# Altium schematic sheet I2S Audio.SchDoc: I2S Codec/Amplifier
size Tabloid; ApprovedBy: NA; CompanyName: Cospan Design LLC; DrawnBy: Dave McCoy; Engineer: Dave McCoy; DocumentNumber: 13; Revision: A; SheetNumber: 13; SheetTotal: 20; Client: Public; Project: Enigma; ProjectPrettyName: Enigma
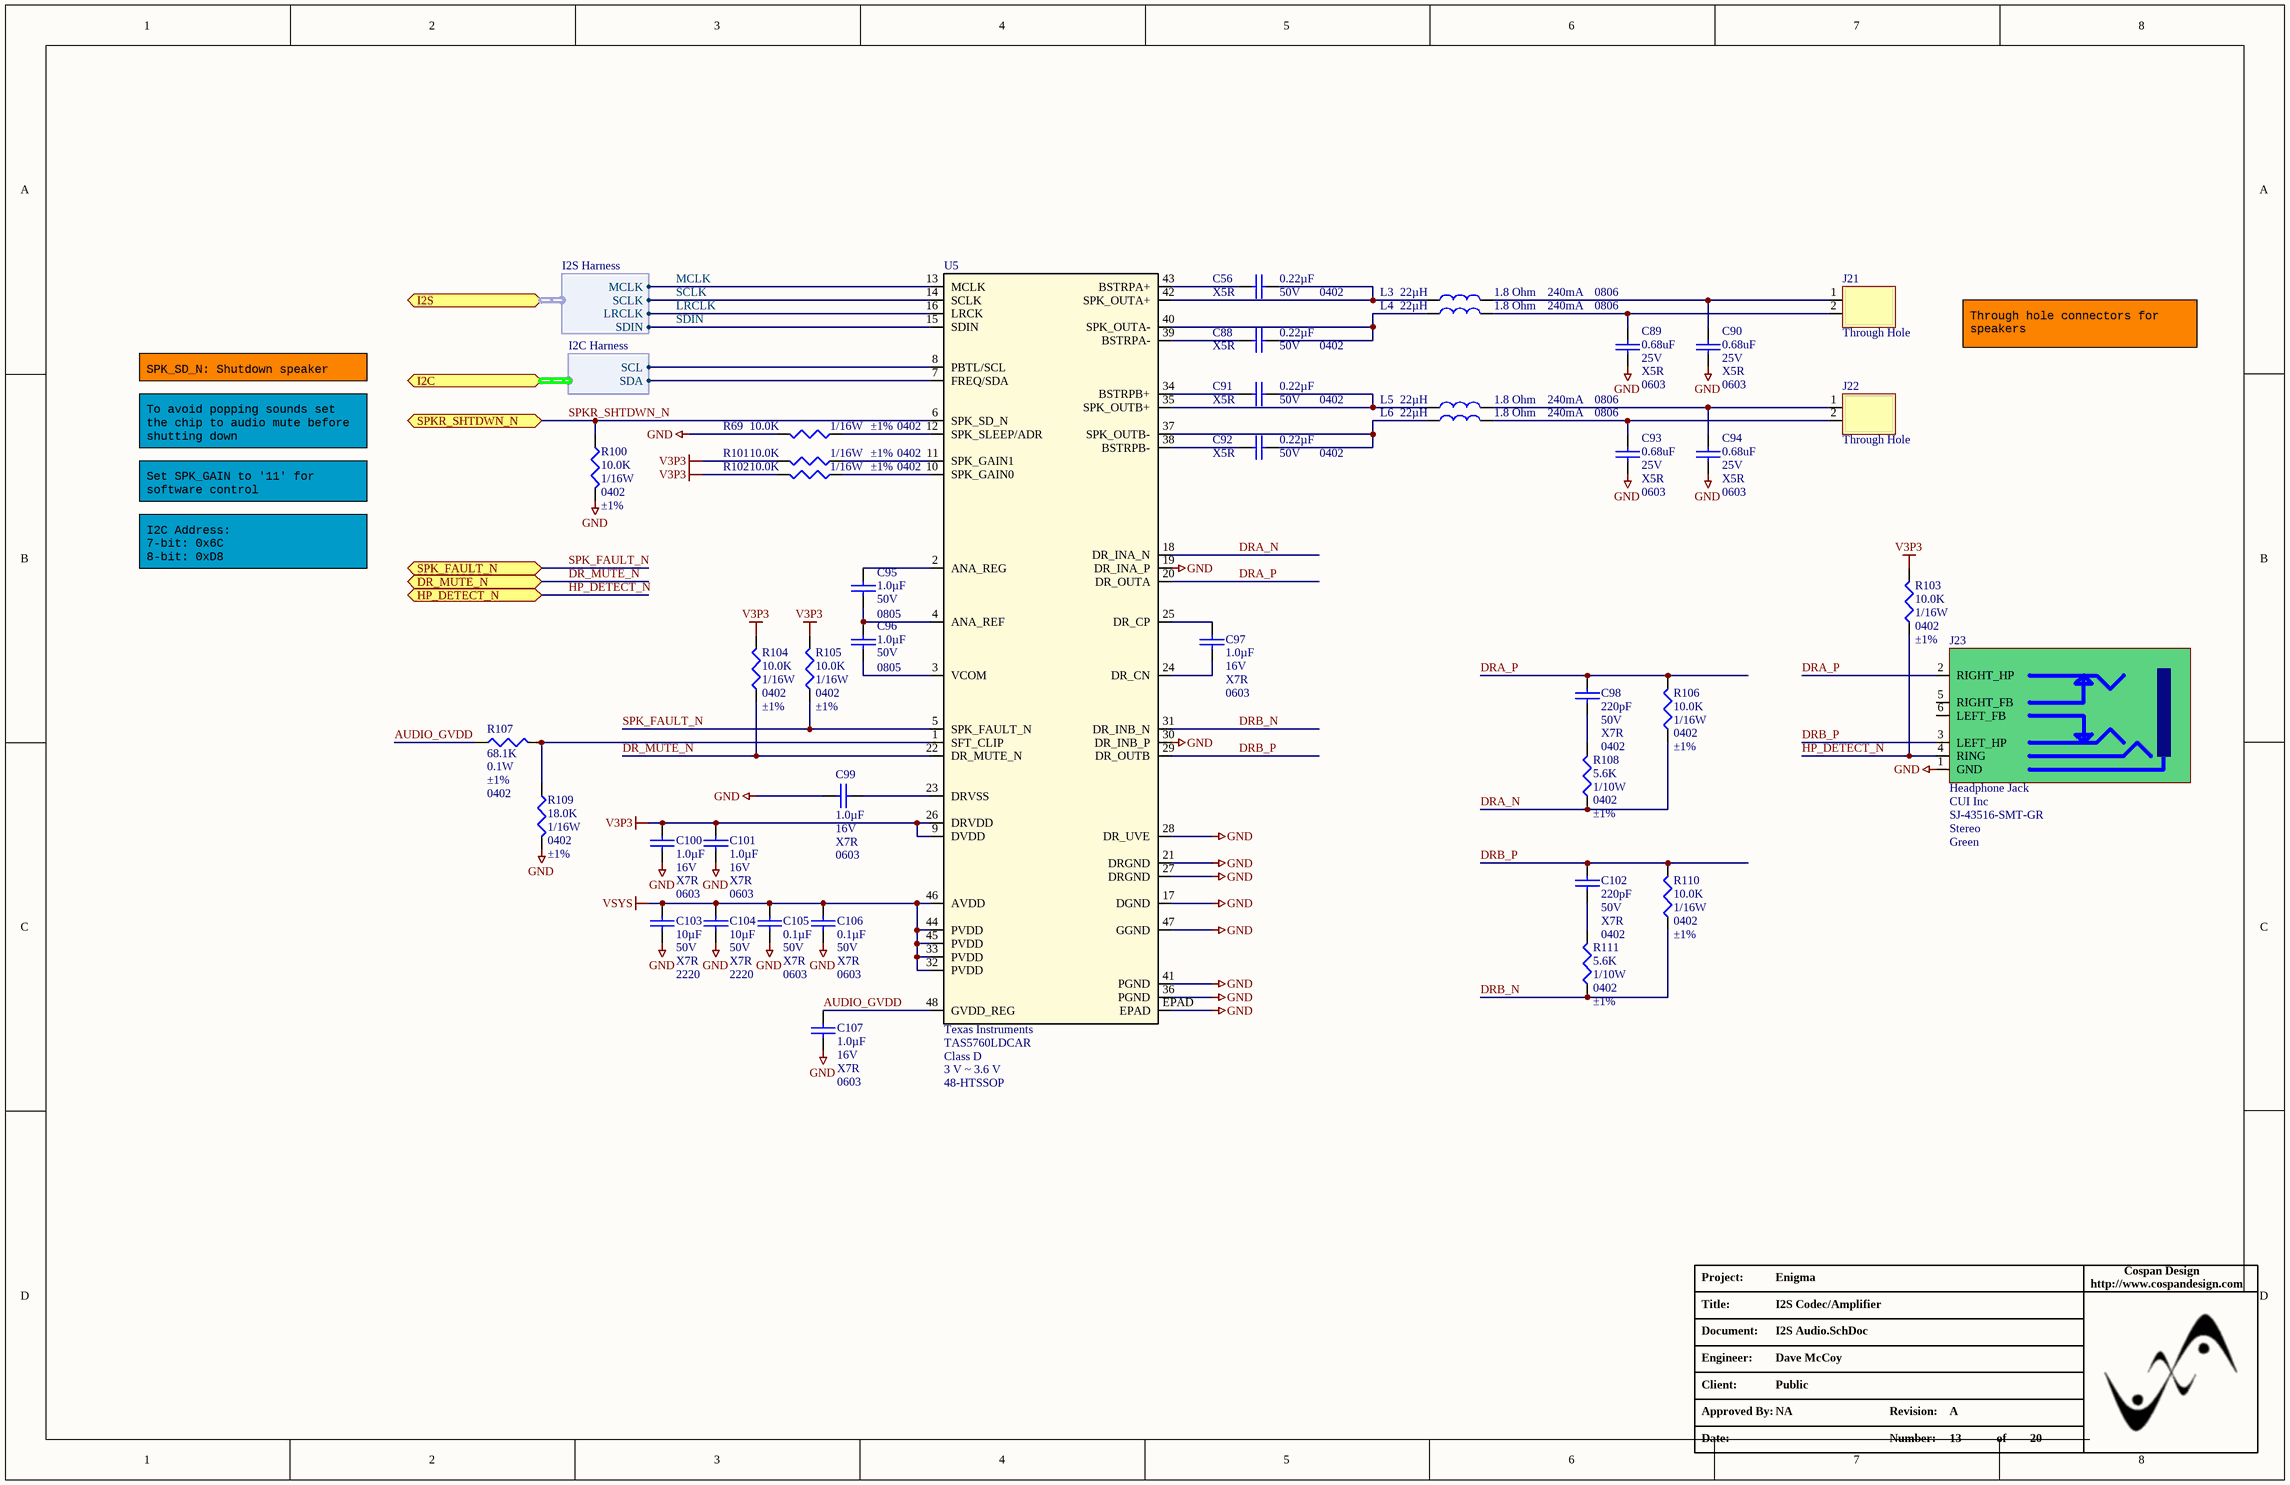
[diagram p0: I2S Audio.SchDoc]

## Parts
C56  Capacitance: 0.22µF  Voltage - Rated: 50V  Temperature Coefficient: X5R  Package / Case: 0402  [C_0402]  (hidden comment: C_0402_0.22UF_50V)
C88  Capacitance: 0.22µF  Voltage - Rated: 50V  Temperature Coefficient: X5R  Package / Case: 0402  [C_0402]  (hidden comment: C_0402_0.22UF_50V)
C89  Capacitance: 0.68uF  Voltage - Rated: 25V  Temperature Coefficient: X5R  Package / Case: 0603  [C_ERA-0603]  (hidden comment: C_0603_0.68uF_25V)
C90  Capacitance: 0.68uF  Voltage - Rated: 25V  Temperature Coefficient: X5R  Package / Case: 0603  [C_ERA-0603]  (hidden comment: C_0603_0.68uF_25V)
C91  Capacitance: 0.22µF  Voltage - Rated: 50V  Temperature Coefficient: X5R  Package / Case: 0402  [C_0402]  (hidden comment: C_0402_0.22UF_50V)
C92  Capacitance: 0.22µF  Voltage - Rated: 50V  Temperature Coefficient: X5R  Package / Case: 0402  [C_0402]  (hidden comment: C_0402_0.22UF_50V)
C93  Capacitance: 0.68uF  Voltage - Rated: 25V  Temperature Coefficient: X5R  Package / Case: 0603  [C_ERA-0603]  (hidden comment: C_0603_0.68uF_25V)
C94  Capacitance: 0.68uF  Voltage - Rated: 25V  Temperature Coefficient: X5R  Package / Case: 0603  [C_ERA-0603]  (hidden comment: C_0603_0.68uF_25V)
C95  Capacitance: 1.0µF  Voltage - Rated: 50V  Package / Case: 0805  [C_ERA-0805]  (hidden comment: 1.0uF)
C96  Capacitance: 1.0µF  Voltage - Rated: 50V  Package / Case: 0805  [C_ERA-0805]  (hidden comment: 1.0uF)
C97  Capacitance: 1.0µF  Voltage - Rated: 16V  Temperature Coefficient: X7R  Package / Case: 0603  [C_ERA-0603]  (hidden comment: 1.0uF)
C98  Voltage - Rated: 50V  Temperature Coefficient: X7R  Package / Case: 0402  [C_0402]  (hidden comment: 220pF)
C99  Capacitance: 1.0µF  Voltage - Rated: 16V  Temperature Coefficient: X7R  Package / Case: 0603  [C_ERA-0603]  (hidden comment: 1.0uF)
C100  Capacitance: 1.0µF  Voltage - Rated: 16V  Temperature Coefficient: X7R  Package / Case: 0603  [C_ERA-0603]  (hidden comment: 1.0uF)
C101  Capacitance: 1.0µF  Voltage - Rated: 16V  Temperature Coefficient: X7R  Package / Case: 0603  [C_ERA-0603]  (hidden comment: 1.0uF)
C102  Voltage - Rated: 50V  Temperature Coefficient: X7R  Package / Case: 0402  [C_0402]  (hidden comment: 220pF)
C103  Voltage - Rated: 50V  Temperature Coefficient: X7R  Package / Case: 2220  [C_ERA-2220]  (hidden comment: 10µF)
C104  Voltage - Rated: 50V  Temperature Coefficient: X7R  Package / Case: 2220  [C_ERA-2220]  (hidden comment: 10µF)
C105  Capacitance: 0.1µF  Voltage - Rated: 50V  Temperature Coefficient: X7R  Package / Case: 0603  [C_ERA-0603]  (hidden comment: C_0603_0.1µF)
C106  Capacitance: 0.1µF  Voltage - Rated: 50V  Temperature Coefficient: X7R  Package / Case: 0603  [C_ERA-0603]  (hidden comment: C_0603_0.1µF)
C107  Capacitance: 1.0µF  Voltage - Rated: 16V  Temperature Coefficient: X7R  Package / Case: 0603  [C_ERA-0603]  (hidden comment: 1.0uF)
J21  Mounting Type: Through Hole  [HDR_1X2]  (hidden comment: J_HDR1X2_JUMPER)  (no BOM)
J22  Mounting Type: Through Hole  [HDR_1X2]  (hidden comment: J_HDR1X2_JUMPER)  (no BOM)
J23  Headphone Jack  Manufacturer: CUI Inc  Manufacturer Part Number: SJ-43516-SMT-GR  Signal Lines: Stereo  Color: Green  [HEADPHONE_JACK]
L3  Current: 240mA  Package / Case: 0806  Inductance: 22µH  DC Resistance (DCR): 1.8 Ohm  [L_0806]  (hidden comment: CBC2016T220K)
L4  Current: 240mA  Package / Case: 0806  Inductance: 22µH  DC Resistance (DCR): 1.8 Ohm  [L_0806]  (hidden comment: CBC2016T220K)
L5  Current: 240mA  Package / Case: 0806  Inductance: 22µH  DC Resistance (DCR): 1.8 Ohm  [L_0806]  (hidden comment: CBC2016T220K)
L6  Current: 240mA  Package / Case: 0806  Inductance: 22µH  DC Resistance (DCR): 1.8 Ohm  [L_0806]  (hidden comment: CBC2016T220K)
R69  Resistance In Ohms: 10.0K  Power (Watts): 1/16W  Case: 0402  Tolerance: ±1%  [R_0402]  (hidden comment: R_0402_10.0K)
R100  Resistance In Ohms: 10.0K  Power (Watts): 1/16W  Case: 0402  Tolerance: ±1%  [R_0402]  (hidden comment: R_0402_10.0K)
R101  Resistance In Ohms: 10.0K  Power (Watts): 1/16W  Case: 0402  Tolerance: ±1%  [R_0402]  (hidden comment: R_0402_10.0K)
R102  Resistance In Ohms: 10.0K  Power (Watts): 1/16W  Case: 0402  Tolerance: ±1%  [R_0402]  (hidden comment: R_0402_10.0K)
R103  Resistance In Ohms: 10.0K  Power (Watts): 1/16W  Case: 0402  Tolerance: ±1%  [R_0402]  (hidden comment: R_0402_10.0K)
R104  Resistance In Ohms: 10.0K  Power (Watts): 1/16W  Case: 0402  Tolerance: ±1%  [R_0402]  (hidden comment: R_0402_10.0K)
R105  Resistance In Ohms: 10.0K  Power (Watts): 1/16W  Case: 0402  Tolerance: ±1%  [R_0402]  (hidden comment: R_0402_10.0K)
R106  Resistance In Ohms: 10.0K  Power (Watts): 1/16W  Case: 0402  Tolerance: ±1%  [R_0402]  (hidden comment: R_0402_10.0K)
R107  Resistance In Ohms: 68.1K  Power (Watts): 0.1W  Tolerance: ±1%  Case: 0402  [R_0402]  (hidden comment: R_0402_68.1K)
R108  Resistance In Ohms: 5.6K  Power (Watts): 1/10W  Case: 0402  Tolerance: ±1%  [R_0402]  (hidden comment: 5.6k Ohms)
R109  Resistance In Ohms: 18.0K  Power (Watts): 1/16W  Case: 0402  Tolerance: ±1%  [R_0402]  (hidden comment: 18.0k Ohms)
R110  Resistance In Ohms: 10.0K  Power (Watts): 1/16W  Case: 0402  Tolerance: ±1%  [R_0402]  (hidden comment: R_0402_10.0K)
R111  Resistance In Ohms: 5.6K  Power (Watts): 1/10W  Case: 0402  Tolerance: ±1%  [R_0402]  (hidden comment: 5.6k Ohms)
U5  Manufacturer: Texas Instruments  Manufacturer Part Number: TAS5760LDCAR  Type: Class D  Voltage - Supply: 3 V ~ 3.6 V  Supplier Device Package: 48-HTSSOP  [DCA48_6P4X3P6]  (hidden comment: U_TAS5760LDCAR)

## Ports
DR_MUTE_N, HP_DETECT_N, I2C (harness I2C Harness), I2S (harness I2S Harness), SPK_FAULT_N, SPKR_SHTDWN_N

## Harnesses
I2C Harness: SCL, SDA
I2S Harness: MCLK, SCLK, LRCLK, SDIN

## Nets
GND: C89.1 C90.1 C93.1 C94.1 C99.1 C100.1 C101.1 C103.1 C104.1 C105.1 C106.1 C107.1 J23.1(GND) R69.1 R100.1 R109.2 U5.17(DGND) U5.19(DR_INA_P) U5.21(DRGND) U5.27(DRGND) U5.28(DR_UVE) U5.30(DR_INB_P) U5.36(PGND) U5.41(PGND) U5.47(GGND) U5.EPAD
V3P3: C100.2 C101.2 R101.1 R102.1 R103.1 R104.2 R105.2 U5.9(DVDD) U5.26(DRVDD)
VSYS: C103.2 C104.2 C105.2 C106.2 U5.32(PVDD) U5.33(PVDD) U5.44(PVDD) U5.45(PVDD) U5.46(AVDD)
AUDIO_GVDD: C107.2 R107.1 U5.48(GVDD_REG)
DR_MUTE_N: R104.1 U5.22(DR_MUTE_N) ; port DR_MUTE_N
DRA_N: R106.2 R108.2 U5.18(DR_INA_N)
DRA_P: C98.2 J23.2(RIGHT_HP) R106.1 U5.20(DR_OUTA)
DRB_N: R110.2 R111.2 U5.31(DR_INB_N)
DRB_P: C102.2 J23.3(LEFT_HP) R110.1 U5.29(DR_OUTB)
HP_DETECT_N: J23.4(RING) R103.2 ; port HP_DETECT_N
LRCLK: U5.16(LRCK) ; port I2S.LRCLK
MCLK: U5.13(MCLK) ; port I2S.MCLK
SCLK: U5.14(SCLK) ; port I2S.SCLK
SDIN: U5.15(SDIN) ; port I2S.SDIN
SPK_FAULT_N: R105.1 U5.5(SPK_FAULT_N) ; port SPK_FAULT_N
SPKR_SHTDWN_N: R100.2 U5.6(SPK_SD_N) ; port SPKR_SHTDWN_N
NetC56_1: C56.1 L3.1 U5.42(SPK_OUTA+)
NetC56_2: C56.2 U5.43(BSTRPA+)
NetC88_1: C88.1 L4.1 U5.40(SPK_OUTA-)
NetC88_2: C88.2 U5.39(BSTRPA-)
NetC89_2: C89.2 J21.2 L4.2
NetC90_2: C90.2 J21.1 L3.2
NetC91_1: C91.1 L5.1 U5.35(SPK_OUTB+)
NetC91_2: C91.2 U5.34(BSTRPB+)
NetC92_1: C92.1 L6.1 U5.37(SPK_OUTB-)
NetC92_2: C92.2 U5.38(BSTRPB-)
NetC93_2: C93.2 J22.2 L6.2
NetC94_2: C94.2 J22.1 L5.2
NetC95_1: C95.1 C96.2 U5.4(ANA_REF)
NetC95_2: C95.2 U5.2(ANA_REG)
NetC96_1: C96.1 U5.3(VCOM)
NetC97_1: C97.1 U5.24(DR_CN)
NetC97_2: C97.2 U5.25(DR_CP)
NetC98_1: C98.1 R108.1
NetC99_2: C99.2 U5.23(DRVSS)
NetC102_1: C102.1 R111.1
NetR69_2: R69.2 U5.12(SPK_SLEEP/ADR)
NetR101_2: R101.2 U5.11(SPK_GAIN1)
NetR102_2: R102.2 U5.10(SPK_GAIN0)
NetR107_2: R107.2 R109.1 U5.1(SFT_CLIP)
NetU5_7: U5.7(FREQ/SDA) ; port I2C.SDA
NetU5_8: U5.8(PBTL/SCL) ; port I2C.SCL

Not connected (* = marked no-connect by the designer): J23 5(RIGHT_FB) 6(LEFT_FB)

## Notes on the sheet
- Through hole connectors for speakers
- SPK_SD_N: Shutdown speaker
- Set SPK_GAIN to '11' for software control
- To avoid popping sounds set the chip to audio mute before shutting down
- I2C Address:
  7-bit: 0x6C
  8-bit: 0xD8
- Project:
- http://www.cospandesign.com
- Cospan Design
- Document:
- Engineer:
- Title:
- Client:
- Approved By:
- Revision:
- Date:
- Number:
- of

## Library data of the parts
C56 C88 C91 C92 = C_0402_0.22UF_50V: CAP CER 0.22UF 50V X5R 0402; Manufacturer: Taiyo Yuden; Manufacturer Part Number: UMK105BJ224KV-F; Tolerance: ±10%; Supplier 1: Digi-Key; RoHS: RoHS Compliant; Category: Capacitors; Stock 1: 141424; Pricing 1: 1=0.35, 10=0.263, 50=0.1532, 100=0.1225, 250=0.08752, 500=0.0595, 1000=0.04813, 5000=0.03763 (USD); Packaging: Digi-Reel®; Mounting Type: Surface Mount, MLCC; Operating Temperature: -55°C ~ 85°C; Applications: General Purpose; Ratings: -; Size / Dimension: 0.039" L x 0.020" W (1.00mm x 0.50mm); Height - Seated (Max): -; Thickness (Max): 0.022" (0.55mm); Lead Spacing: -; Features: -; Lead Style: -; ComponentLink1URL: http://ds.yuden.co.jp/TYCOMPAS/ut/detail.do?productNo=UMK105BJ224KV-F&fileName=UMK105BJ224KV-F_SS&mode=specSheetDownload; ComponentLink1Description: http://ds.yuden.co.jp/TYCOMPAS/ut/detail.do?productNo=UMK105BJ224KV-F&fileName=UMK105BJ224KV-F_SS&mode=specSheetDownload; Supplier Part Number 1: 587-3500-6-ND
C89 C90 C93 C94 = C_0603_0.68uF_25V: CAP CER 0.68UF 25V X5R 0603; Manufacturer: Wurth Electronics Inc.; Manufacturer Part Number: 885012106021; Tolerance: ±20%; Supplier 1: Digi-Key; RoHS: RoHS Compliant; Category: Capacitors; Stock 1: 3388; Pricing 1: 1=0.16, 50=0.131, 100=0.103, 250=0.091, 500=0.083, 1000=0.077 (USD); Packaging: Cut Tape (CT); Part Status: Active; Operating Temperature: -55°C ~ 85°C; Features: -; Ratings: -; Applications: General Purpose; Mounting Type: Surface Mount, MLCC; Size / Dimension: 0.063" L x 0.031" W (1.60mm x 0.80mm); Height - Seated (Max): -; Thickness (Max): 0.037" (0.95mm); Lead Spacing: -; Lead Style: -; ComponentLink1URL: http://katalog.we-online.de/pbs/datasheet/885012106021.pdf; ComponentLink1Description: http://katalog.we-online.de/pbs/datasheet/885012106021.pdf; Supplier Part Number 1: 732-7918-1-ND
C95 C96 = C_0805_1.0uF_50V: CAP CER 1UF 50V X7R 0805; Manufacturer: Murata Electronics North America; Manufacturer Part Number: GRM21BR71H105KA12L; Tolerance: ±10%; Supplier 1: Digi-Key; RoHS: RoHS Compliant; Category: Capacitors; Stock 1: 322160; Pricing 1: 10=0.529, 100=0.3127, 500=0.18038, 1000=0.12506 (USD); Mounting Type: Surface Mount, MLCC; Operating Temperature: -55°C ~ 125°C; Features: -; Applications: General Purpose; Ratings: -; Size / Dimension: 0.079" L x 0.049" W (2.00mm x 1.25mm); Lead Spacing: -; Thickness: 1.25mm; Packaging: Cut Tape (CT); Lead Style: -; ComponentLink1URL: http://search.murata.co.jp/Ceramy/image/img/PDF/ENG/GRM21BR71H105KA12.pdf; ComponentLink1Description: http://search.murata.co.jp/Ceramy/image/img/PDF/ENG/GRM21BR71H105KA12.pdf; Supplier Part Number 1: 490-4736-1-ND; Temperature Coefficient: X7R
C97 C99-C101 C107 = C_0603_1.0uF_16V: CAP CER 1UF 16V 10% X7R 0603; Manufacturer: Yageo; Manufacturer Part Number: CC0603KRX7R7BB105; Description: CAP CER 1UF 16V X7R 0603; Supplier 1: Digi-Key; Supplier Part Number 1: 311-1446-1-ND; RoHS: RoHS Compliant; Category: Capacitors; Stock 1: 221087; Tolerance: ±10%; Mounting Type: Surface Mount, MLCC; Operating Temperature: -55°C ~ 125°C; Applications: General Purpose; Ratings: -; Size / Dimension: 0.063" L x 0.032" W (1.60mm x 0.80mm); Height - Seated (Max): -; Thickness (Max): 0.035" (0.90mm); Lead Spacing: -; Features: -; Packaging: Cut Tape (CT); Lead Style: -; ComponentLink1URL: http://www.yageo.com/documents/recent/UPY-GPHC_X7R_6.3V-to-50V_18.pdf; ComponentLink1Description: http://www.yageo.com/documents/recent/UPY-GPHC_X7R_6.3V-to-50V_18.pdf; Pricing 1: 1=0.1, 10=0.053, 100=0.0237, 500=0.01694, 1000=0.01331 (USD); Part Status: Active; Failure Rate: -
C98 C102 = C_0402_220PF_50V: CAP CER 220PF 50V 10% X7R 0402; Manufacturer: Murata Electronics North America; Manufacturer Part Number: GRM155R71H221KA01D; Supplier 1: Digi-Key; Supplier Part Number 1: 490-1298-1-ND; RoHS: RoHS Compliant; Category: Capacitors; Stock 1: 239876; Pricing: 10=0.034, 50=0.0272, 100=0.0204, 250=0.01476, 500=0.0109, 1000=0.00738 (USD); Tolerance: ±10%; Mounting Type: Surface Mount, MLCC; Operating Temperature: -55°C ~ 125°C; Applications: General Purpose; Ratings: -; Size / Dimension: 0.039" L x 0.020" W (1.00mm x 0.50mm); Height: -; Thickness: 0.022" (0.55mm); Lead Spacing: -; Features: -; Packaging: Cut Tape (CT); Lead Style: -; ComponentLink1URL: http://search.murata.co.jp/Ceramy/image/img/PDF/ENG/GRM155R71H221KA01.pdf; ComponentLink1Description: http://search.murata.co.jp/Ceramy/image/img/PDF/ENG/GRM155R71H221KA01.pdf; Capacitance: 220pF
C103 C104 = C_2220_10UF_50V: CAP CER 10UF 50V X7R 20% 2220; Manufacturer: TDK Corporation; Manufacturer Part Number: C5750X7R1H106K230KB; Tolerance: ±10%; Description: CAP CER 10UF 50V X7R 2220; Supplier 1: Digi-Key; RoHS: RoHS Compliant; Category: Capacitors; Stock 1: 35258; Pricing 1: 1=1.96, 10=1.583, 100=1.2087 (USD); Packaging: Cut Tape (CT); Part Status: Active; Operating Temperature: -55°C ~ 125°C; Features: -; Ratings: -; Applications: General Purpose; Failure Rate: -; Mounting Type: Surface Mount, MLCC; Size / Dimension: 0.224" L x 0.197" W (5.70mm x 5.00mm); Height - Seated (Max): -; Thickness (Max): 0.098" (2.50mm); Lead Spacing: -; Lead Style: -; ComponentLink1URL: https://product.tdk.com/info/en/catalog/datasheets/mlcc_commercial_general_en.pdf; ComponentLink1Description: https://product.tdk.com/info/en/catalog/datasheets/mlcc_commercial_general_en.pdf; Supplier Part Number 1: 445-3492-1-ND; Capacitance: 10µF
C105 C106 = C_0603_0.1µF: CAP CER 0.1UF 50V X7R 0603; Manufacturer: Samsung Electro-Mechanics America, Inc.; Manufacturer Part Number: CL10B104KB8SFNC; Tolerance: ±10%; Supplier 1: Digi-Key; RoHS: RoHS Compliant; Category: Capacitors; Stock 1: 1364172; Pricing 1: 1=0.1, 10=0.027, 25=0.0192, 50=0.0148, 100=0.0125, 500=0.00874, 1000=0.00681 (USD); Packaging: Cut Tape (CT); Mounting Type: Surface Mount, MLCC; Operating Temperature: -55°C ~ 125°C; Applications: Boardflex Sensitive; Ratings: -; Size / Dimension: 0.063" L x 0.031" W (1.60mm x 0.80mm); Height - Seated (Max): -; Thickness (Max): 0.035" (0.90mm); Lead Spacing: -; Features: Soft Termination; Lead Style: -; ComponentLink1URL: http://www.samsungsem.com/kr/support/product-search/mlcc/CL10B104KB8SFNC.jsp; ComponentLink1Description: http://www.samsungsem.com/kr/support/product-search/mlcc/CL10B104KB8SFNC.jsp; Supplier Part Number 1: 1276-1936-1-ND; Supplier 2: Digi-Key; Stock 2: 470947; Pricing 2: 1=0.1, 10=0.026, 50=0.0144, 100=0.0121, 250=0.00992, 500=0.00848, 1000=0.0066 (USD); ComponentLink2URL: http://www.kemet.com/docfinder?Partnumber=C0603C104M5RACTU; ComponentLink2Description: http://www.kemet.com/docfinder?Partnumber=C0603C104M5RACTU; Supplier Part Number 2: 399-7845-1-ND
J21 J22 = J_HDR1X2_JUMPER: CONN HEADER .100" 2POS TIN PCB; Manufacturer: Samtec; Manufacturer Part Number: TSW-102-07-T-S; Number of Positions: 2; Connector Type: Unshrouded; Number of Positions Loaded: All; Pitch: 0.100" (2.54mm); NOTE: This is a 1X12 header; Category: Connectors, Interconnects; Number of Rows: 1; Supplier 1: Samtec; Supplier Part Number 1: TSW-102-07-T-S; RoHS: RoHS Compliant; Row Spacing: -; Height Stacking (Mating): -; Molding Height Above Board: 0.100" (2.54mm); Contact Mating Length: 0.166" (4.22mm); Termination: Solder; Contact Finish: Tin; Contact Finish Thickness: 200µin (5.08µm); Features: -; Color: Black; ComponentLink1URL: http://www.samtec.com/ftppub/pdf/TD.PDF; ComponentLink1Description: http://www.samtec.com/ftppub/pdf/TD.PDF
J23 = J_HEADPHONE_JACK: CONN AUDIO JACK 3.5MM 4COND SMD; Gender: Female; Plug/Mating Plug Diameter: 3.50mm (0.141", 1/8", Mini Plug) - Headphone; Number of Positions/Contacts: 4 Conductors, 6 Contacts; Internal Switch(s): Two Switches; Shielding: Unshielded; Supplier 1: Digi-Key; Supplier Part Number 1: CP-43516SJGRCT-ND; RoHS: RoHS Compliant; Category: Connectors, Interconnects; Stock 1: 3934; Pricing: 1=1.26, 10=0.982, 100=0.749, 500=0.59796 (USD); Connector Type: Phone Jack; Mounting Type: Surface Mount, Right Angle; Termination: Solder; Features: Board Guide; Packaging: Cut Tape (CT); ComponentLink1URL: http://products.cui.com/GetSpecForDigikey.aspx?MFGNum=SJ-43516-SMT; ComponentLink1Description: http://products.cui.com/GetSpecForDigikey.aspx?MFGNum=SJ-43516-SMT
L3-L6 = L_0806_22uH: INDUCTOR 22UH 10% 0806 SMD; Manufacturer: Taiyo Yuden; Type: Wirewound; Current - Saturation: 250mA; Shielding: Unshielded; Frequency - Self Resonant: 16MHz; Frequency - Test: 2.52MHz; Supplier 1: Digi-Key; Supplier Part Number 1: 587-3048-1-ND; Manufacturer Part Number: CBC2016T220K; RoHS: RoHS Compliant; Category: Inductors, Coils, Chokes; Stock 1: 3275; Pricing: 1=0.2, 10=0.192, 50=0.18, 100=0.168, 500=0.132, 1000=0.108 (USD); Packaging: Cut Tape (CT); Material - Core: -; Tolerance: ±10%; Current Rating: 240mA; Q @ Freq: -; Operating Temperature: -40°C ~ 105°C; Mounting Type: Surface Mount; Size / Dimension: 0.079" L x 0.063"W (2.00mm x 1.60mm); Height - Seated (Max): 0.071" (1.80mm); Supplier Device Package: 0806 (2016 Metric); ComponentLink1URL: http://www.yuden.co.jp/ut/product/category/inductor/CBC2016T220K.pdf; ComponentLink1Description: http://www.yuden.co.jp/ut/product/category/inductor/CBC2016T220K.pdf
R69 R100-R106 R110 = R_0402_10.0K: RES 10.0K OHM 1/16W 1% 0402 SMD; Manufacturer: Stackpole Electronics Inc; Manufacturer Part Number: RMCF0402FT10K0; Resistance (Ohms): 10k; Temperature Coefficient: ±100ppm/°C; Supplier 1: Digi-Key; Supplier Part Number 1: RMCF0402FT10K0CT-ND; RoHS: RoHS Compliant; Category: Resistors; Stock 1: 234525; Pricing: 1=0.04, 10=0.025, 50=0.0138, 100=0.0105, 250=0.0078, 500=0.00576, 1000=0.00384, 2500=0.00324, 5000=0.0027 (USD); Composition: Thick Film; Features: -; Package / Case: 0402 (1005 Metric); Size / Dimension: 0.039" L x 0.020" W (1.00mm x 0.50mm); Height: 0.016" (0.40mm); Number of Terminations: 2; Packaging: Cut Tape (CT); ComponentLink1URL: http://www.seielect.com/Catalog/SEI-RMCF_RMCP.pdf; ComponentLink1Description: http://www.seielect.com/Catalog/SEI-RMCF_RMCP.pdf
R107 = R_0402_68.1K: RES 68.1K OHM 1/10W 1% 0402 SMD; Manufacturer: Panasonic - ECG; Manufacturer Part Number: ERJ-2RKF6812X; Temperature Coefficient: ±100ppm/°C; Supplier 1: Digi-Key; Supplier Part Number 1: P68.1KLCT-ND; RoHS: RoHS Compliant; Category: Resistors; Stock 1: 314739; Pricing: 1=0.06, 50=0.0242, 100=0.0184, 250=0.01364, 500=0.01008, 1000=0.00672, 5000=0.00473 (USD); Resistance (Ohms): 68.1K; Composition: Thick Film; Features: -; Size / Dimension: 0.039" L x 0.020" W (1.00mm x 0.50mm); Height: 0.014" (0.35mm); Number of Terminations: 2; Packaging: Cut Tape (CT); Package / Case: 0402 (1005 Metric); ComponentLink1URL: http://industrial.panasonic.com/www-cgi/jvcr13pz.cgi?E+PZ+3+AOA0002+ERJ2RKF6812X+7+WW; ComponentLink1Description: http://industrial.panasonic.com/www-cgi/jvcr13pz.cgi?E+PZ+3+AOA0002+ERJ2RKF6812X+7+WW
R108 R111 = R_0402_5.6K: RES 5.60K OHM 1/10W 1% 0402 SMD; Manufacturer: Yageo; Manufacturer Part Number: RC0402FR-075K6L; Temperature Coefficient: ±100ppm/°C; Description: RES SMD 5.6K OHM 1% 1/16W 0402; Supplier 1: Digi-Key; Supplier Part Number 1: 311-5.6KLRCT-ND; RoHS: RoHS Compliant; Category: Resistors; Stock 1: 1026789; Composition: Thick Film; Features: Moisture Resistant; Package / Case: 0402 (1005 Metric); Size / Dimension: 0.039" L x 0.020" W (1.00mm x 0.50mm); Packaging: Cut Tape (CT); ComponentLink1URL: http://www.yageo.com/documents/recent/PYu-RC_Group_51_RoHS_L_7.pdf; ComponentLink1Description: http://www.yageo.com/documents/recent/PYu-RC_Group_51_RoHS_L_7.pdf; Pricing 1: 1=0.1, 10=0.014, 100=0.0056, 1000=0.00253, 2500=0.0022, 5000=0.00181 (USD); Part Status: Active; Operating Temperature: -55°C ~ 155°C; Supplier Device Package: 0402; Height - Seated (Max): 0.016" (0.40mm); Failure Rate: -
R109 = R_0402_18.0K: RES SMD 18K OHM 1% 1/16W 0402; Manufacturer: Yageo; Manufacturer Part Number: RC0402FR-0718KL; Temperature Coefficient: ±100ppm/°C; Supplier 1: Digi-Key; Supplier Part Number 1: 311-18.0KLRCT-ND; RoHS: RoHS Compliant; Category: Resistors; Stock 1: 2103351; Pricing: 10=0.014, 100=0.0063, 500=0.00382, 1000=0.0027, 5000=0.00203 (USD); Resistance (Ohms): 18K; Composition: Thick Film; Features: -; Package / Case: 0402 (1005 Metric); Size / Dimension: 0.039" L x 0.020" W (1.00mm x 0.50mm); Height: 0.016" (0.40mm); Number of Terminations: 2; Packaging: Cut Tape (CT); ComponentLink1URL: http://www.yageo.com/documents/recent/PYu-RC0402_51_RoHS_L_6.pdf; ComponentLink1Description: http://www.yageo.com/documents/recent/PYu-RC0402_51_RoHS_L_6.pdf
U5 = U_TAS5760LDCAR: IC AUDIO AMP DGTL D 48HTSSOP; Output Type: 1-Channel (Mono) or 2-Channel (Stereo); Supplier 1: Digi-Key; RoHS: RoHS Compliant; Category: Integrated Circuits (ICs); Stock 1: 1188; Pricing 1: 1=4.64, 10=4.17, 100=3.4165, 500=2.90836, 1000=2.45284 (USD); Packaging: Cut Tape (CT); Part Status: Active; Max Output Power x Channels @ Load: -; Features: Depop; Mounting Type: Surface Mount; Operating Temperature: -25°C ~ 85°C (TA); Package / Case: 48-TFSOP (0.240", 6.10mm Width) Exposed Pad; ComponentLink1URL: http://www.ti.com/lit/ds/symlink/tas5760l.pdf; ComponentLink1Description: http://www.ti.com/lit/ds/symlink/tas5760l.pdf; Supplier Part Number 1: 296-40566-1-ND